# EAGLE schematic DAC-v1 (EAGLE 7.6.0)
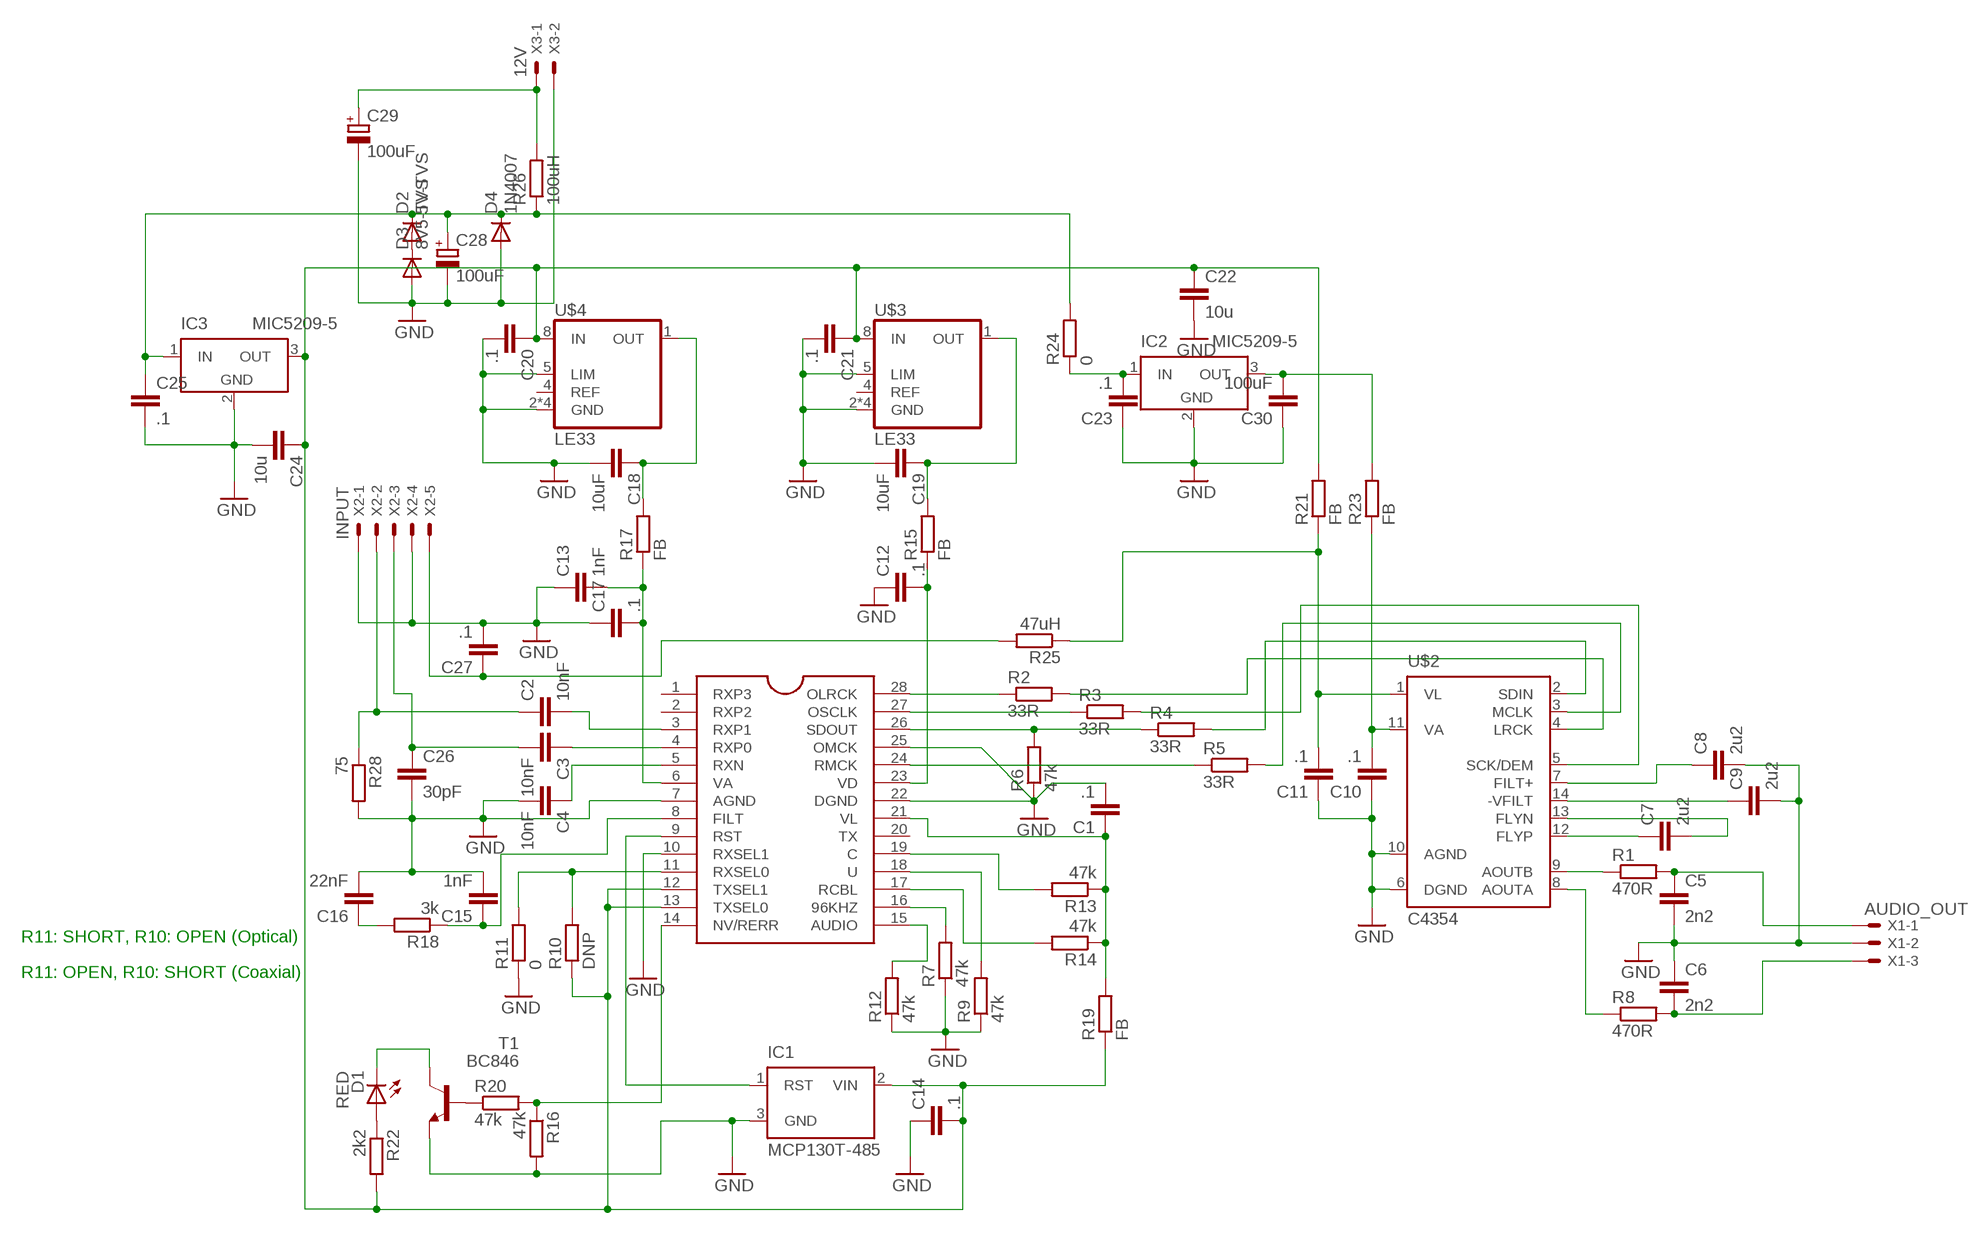
[diagram p0: schematic, sheet 1]

## Parts
C1  .1  C-EUC1206  [C1206]
C2  10nF  C-EUC1206  [C1206]
C3  10nF  C-EUC1206  [C1206]
C4  10nF  C-EUC1206  [C1206]
C5  2n2  C-EUC1210  [C1210]
C6  2n2  C-EUC1210  [C1210]
C7  2u2  C-EUC1210  [C1210]
C8  2u2  C-EUC1210  [C1210]
C9  2u2  C-EUC1210  [C1210]
C10  .1  C-EUC1210  [C1210]
C11  .1  C-EUC1210  [C1210]
C12  .1  C-EUC0805  [C0805]
C13  1nF  C-EUC1206  [C1206]
C14  .1  C-EUC0805  [C0805]
C15  1nF  C-EUC0805  [C0805]
C16  22nF  C-EUC0805  [C0805]
C17  .1  C-EUC0805  [C0805]
C18  10uF  C-EUC1206  [C1206]
C19  10uF  C-EUC1206  [C1206]
C20  .1  C-EUC0805  [C0805]
C21  .1  C-EUC0805  [C0805]
C22  10u  C-EUC1210  [C1210]
C23  .1  C-EUC1210  [C1210]
C24  10u  C-EUC1210  [C1210]
C25  .1  C-EUC1210  [C1210]
C26  30pF  C-EUC1206  [C1206]
C27  .1  C-EUC0805  [C0805]
C28  100uF  CPOL-EUE2.5-7  [E2,5-7]
C29  100uF  CPOL-EUE2.5-7  [E2,5-7]
C30  100uF  C-EUC1812K  [C1812K]
D1  RED  SFH482  [SFH482]
D2  5V-TVS  1N5059  [DO204-10]
D3  8V5-TVS  1N5059  [DO204-10]
D4  1N4007  1N4004  [DO41-10]
IC1  MCP130T-485  MC15TT  [SOT23]
IC2  MIC5209-5  LT1129CST5  [SOT223]
IC3  MIC5209-5  LT1129CST5  [SOT223]
R1  470R  R-EU_R0805  [R0805]
R2  33R  R-EU_0204/7  [0204/7]
R3  33R  R-EU_0204/7  [0204/7]
R4  33R  R-EU_R1206  [R1206]
R5  33R  R-EU_R1206  [R1206]
R6  47k  R-EU_R1206  [R1206]
R7  47k  R-EU_R1206  [R1206]
R8  470R  R-EU_R0805  [R0805]
R9  47k  R-EU_R1206  [R1206]
R10  DNP  R-EU_R1206  [R1206]
R11  0  R-EU_R1206  [R1206]
R12  47k  R-EU_R1206  [R1206]
R13  47k  R-EU_R1206  [R1206]
R14  47k  R-EU_R1206  [R1206]
R15  FB  R-EU_R1206  [R1206]
R16  47k  R-EU_R1206  [R1206]
R17  FB  R-EU_R1206  [R1206]
R18  3k  R-EU_R0805  [R0805]
R19  FB  R-EU_R1206  [R1206]
R20  47k  R-EU_R1206  [R1206]
R21  FB  R-EU_R1206  [R1206]
R22  2k2  R-EU_R1206  [R1206]
R23  FB  R-EU_R1206  [R1206]
R24  0  R-EU_0204/7  [0204/7]
R25  47uH  R-EU_R1206  [R1206]
R26  100uH  R-EU_0309/12  [0309/12]
R28  75  R-EU_R0805  [R0805]
T1  BC846  [SOT23]
U$1  CS8416  CS8416-HARDWAREMODEHARDWAREMODE  [SO28L]
U$2  C4354  [SO-14]
U$3  LE33  [SO-08]
U$4  LE33  [SO-08]
X1  AUDIO_OUT  22-23-2031  [22-23-2031]
X2  INPUT  22-23-2051  [22-23-2051]
X3  12V  22-23-2021  [22-23-2021]

## Nets
GND: C1.2 C4.2 C5.2 C6.1 C8.2 C9.2 C10.1 C11.1 C12.1 C13.1 C14.1 C15.2 C16.2 C17.1 C18.2 C19.2 C20.2 C21.2 C22.2 C23.1 C24.2 C25.2 C26.2 C27.2 C28.- C29.- C30.1 D3.A D4.A IC1.3(GND) IC2.2(GND) IC3.2(GND) R6.1 R7.1 R9.1 R11.1 R12.1 R16.2 R28.2 T1.2(E) U$1.7(AGND) U$1.10(RXSEL1) U$1.22(DGND) U$1.25(OMCK) U$2.6(DGND) U$2.10(AGND) U$3.2(GND) U$3.3(GND) U$3.5(LIM) U$3.6(GND) U$3.7(GND) U$4.2(GND) U$4.3(GND) U$4.5(LIM) U$4.6(GND) U$4.7(GND) X1.2 X2.1 X2.4 X3.2
N$1: IC1.1(RST) U$1.9(RST)
N$2: R4.1 R6.2 U$1.26(SDOUT)
N$3: C16.1 R18.2
N$4: R5.1 U$1.24(RMCK)
N$5: R3.1 U$1.27(OSCLK)
N$6: R2.1 U$1.28(OLRCK)
N$7: R2.2 U$2.4(LRCK)
N$8: R3.2 U$2.5(SCK/DEM)
N$9: R4.2 U$2.2(SDIN)
N$10: R5.2 U$2.3(MCLK)
N$11: R7.2 U$1.16(96KHZ)
N$12: C3.1 U$1.4(RXP0)
N$13: C2.2 U$1.3(RXP1)
N$14: C4.1 U$1.5(RXN)
N$15: R1.1 U$2.9(AOUTB)
N$16: R8.1 U$2.8(AOUTA)
N$17: C5.1 R1.2 X1.1
N$18: C6.2 R8.2 X1.3
N$19: C13.2 C17.2 R17.1 U$1.6(VA)
N$20: C7.2 U$2.13(FLYN)
N$21: C7.1 U$2.12(FLYP)
N$22: C9.1 U$2.14(-VFILT)
N$23: C8.1 U$2.7(FILT+)
N$24: C12.2 R15.1 U$1.23(VD)
N$25: C11.2 R21.1 R25.1 U$2.1(VL)
N$26: C10.2 R23.1 U$2.11(VA)
N$27: C1.1 R13.1 R14.1 R19.2 U$1.21(VL)
N$28: R9.2 U$1.18(U)
N$29: R16.1 R20.2 U$1.14(NV/RERR)
N$30: R10.2 R11.2 U$1.11(RXSEL0)
N$31: C15.1 R18.1 U$1.8(FILT)
N$32: C30.2 IC2.3(OUT) R23.2
N$33: C18.1 R17.2 U$4.1(OUT)
N$34: R12.2 U$1.15(AUDIO)
N$35: R13.2 U$1.19(C)
N$36: R14.2 U$1.17(RCBL)
N$37: C19.1 R15.2 U$3.1(OUT)
N$38: R20.1 T1.1(B)
N$39: D1.K(C) T1.3(C)
N$40: D1.A R22.1
N$41: C29.+ R26.2 X3.1
N$42: C14.2 C20.1 C21.1 C22.1 C24.1 IC1.2(VIN) IC3.3(OUT) R10.1 R19.1 R21.2 R22.2 U$1.12(TXSEL1) U$1.13(TXSEL0) U$3.8(IN) U$4.8(IN)
N$43: C23.2 IC2.1(IN) R24.1
N$44: C3.2 C26.1 X2.3
N$45: C25.1 C28.+ D2.C D4.C IC3.1(IN) R24.2 R26.1
N$46: C2.1 R28.1 X2.2
N$47: C27.1 R25.2 X2.5
N$49: D2.A D3.C
Unconnected: U$1.1(RXP3) U$1.2(RXP2) U$1.20(TX) U$3.4(REF) U$4.4(REF)

## Notes on the sheet
- R11: SHORT, R10: OPEN (Optical)
- R11: OPEN, R10: SHORT (Coaxial)

## Power pins joined to a net without a drawn wire
GND: IC2.4(GND) IC3.4(GND)

## Library data of the parts
C1-C27 C30 = resistor:C-EU: CAPACITOR, European symbol
C28 C29 = resistor:CPOL-EU: POLARIZED CAPACITOR, European symbol
D1 = led:SFH482: IR LED infrared emitting diode, Infineon
D2 D3 = diode:1N5059: DIODE controlled avalanche rectifier
D4 = diode:1N4004: DIODE general purpose rectifier, 1 A
IC1 = microchip:MC15*: MCP130 Microcontroller Supervisory Circuit with Open Drain Output
IC2 IC3 = linear-technology:LT1129CST5: VOLTAGE REGULATOR with shutdown; MPN: LT1129CST-5#PBF; OC_FARNELL: 1663375; OC_NEWARK: 57M2069
R1-R26 R28 = resistor:R-EU_: RESISTOR, European symbol
T1 = transistor:BC846: NPN TRANSISTOR
U$1 = cirrus-dar:CS8416-HARDWAREMODE: 24bit 192kHz Digital Audio Interface Receiver - Hardware Mode
U$2 = cirrus-logic:C4354
U$3 U$4 = v-reg:LE33
X1 = con-molex:22-23-2031: .100" (2.54mm) Center Header - 3 Pin; MF: MOLEX; MPN: 22-23-2031; OC_FARNELL: 1462950; OC_NEWARK: 30C0862
X2 = con-molex:22-23-2051: .100" (2.54mm) Center Header - 5 Pin; MF: MOLEX; MPN: 22-23-2051; OC_FARNELL: 1462952; OC_NEWARK: 38C9178
X3 = con-molex:22-23-2021: .100" (2.54mm) Center Header - 2 Pin; MF: MOLEX; MPN: 22-23-2021; OC_FARNELL: 1462926; OC_NEWARK: 25C3832